# Altium schematic sheet obc_main_3.0 (1).SchDoc
size A
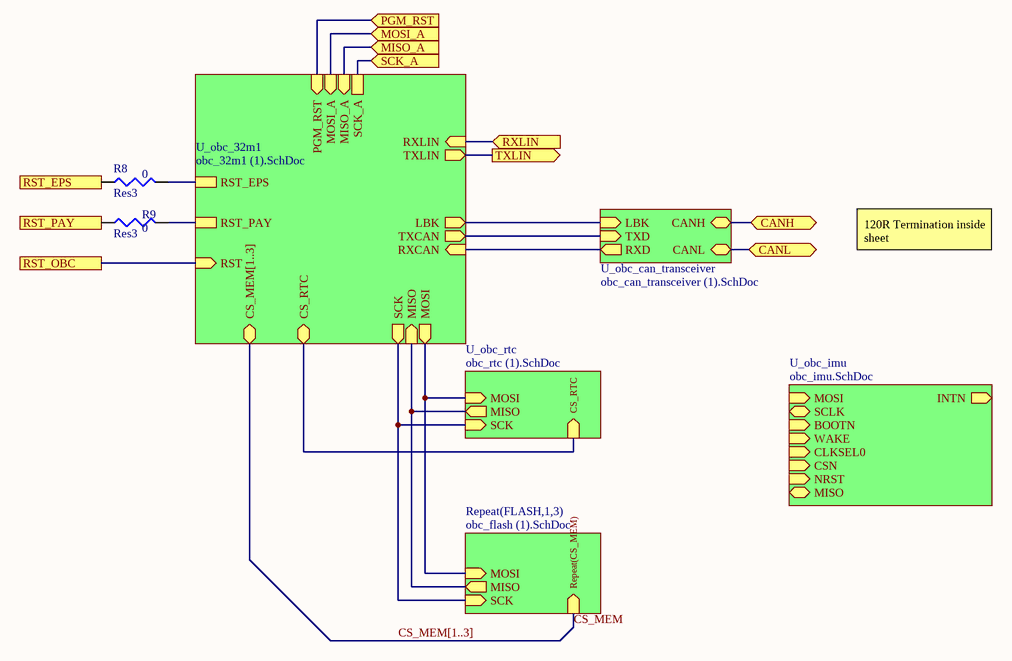
[diagram p0: obc_main_3.0 (1).SchDoc]

## Parts
R8  Res3  value 0  [J1-0603]
R9  Res3  value 0  [J1-0603]

## Sub-sheets
Repeat(FLASH,1,3) = obc_flash (1).SchDoc: MOSI (in), SCK (in), MISO (out), Repeat(CS_MEM) (in)
U_obc_32m1 = obc_32m1 (1).SchDoc: MISO (in), SCK (out), RXLIN (in), CS_RTC (bidir), TXLIN (out), TXCAN (out), RXCAN (in), MOSI (out), LBK (out), RST (in), RST_EPS, RST_PAY, PGM_RST (in), MOSI_A (in), MISO_A (in), SCK_A, CS_MEM[1..3] (bidir)
U_obc_can_transceiver = obc_can_transceiver (1).SchDoc: RXD (out), TXD (in), LBK (in), CANL (bidir), CANH (bidir)
U_obc_imu = obc_imu.SchDoc: MOSI (in), SCLK (bidir), INTN (out), BOOTN (in), WAKE (in), CLKSEL0 (in), CSN (in), NRST (in), MISO (bidir)
U_obc_rtc = obc_rtc (1).SchDoc: CS_RTC (in), MOSI (in), MISO (out), SCK (in)

## Ports
CANH (bidir), CANL (bidir), MISO_A (in), MOSI_A (in), PGM_RST (in), RST_EPS, RST_OBC, RST_PAY, RXLIN (in), SCK_A (in), TXLIN (out)

## Nets
CANH: port CANH, sheet U_obc_can_transceiver/CANH
CANL: port CANL, sheet U_obc_can_transceiver/CANL
CS_MEM: sheet Repeat(FLASH,1,3)/Repeat(CS_MEM)
MISO_A: port MISO_A, sheet U_obc_32m1/MISO_A
MOSI_A: port MOSI_A, sheet U_obc_32m1/MOSI_A
PGM_RST: port PGM_RST, sheet U_obc_32m1/PGM_RST
RST_EPS: R8.1 ; port RST_EPS
RST_OBC: port RST_OBC, sheet U_obc_32m1/RST
RST_PAY: R9.1 ; port RST_PAY
RXLIN: port RXLIN, sheet U_obc_32m1/RXLIN
SCK_A: port SCK_A, sheet U_obc_32m1/SCK_A
TXLIN: port TXLIN, sheet U_obc_32m1/TXLIN
NetR8_2: R8.2 ; sheet U_obc_32m1/RST_EPS
NetR9_2: R9.2 ; sheet U_obc_32m1/RST_PAY
(unnamed): sheet U_obc_32m1/MISO, sheet U_obc_rtc/MISO, sheet Repeat(FLASH,1,3)/MISO
(unnamed): sheet U_obc_32m1/SCK, sheet U_obc_rtc/SCK, sheet Repeat(FLASH,1,3)/SCK
(unnamed): sheet U_obc_32m1/CS_RTC, sheet U_obc_rtc/CS_RTC
(unnamed): sheet U_obc_32m1/TXCAN, sheet U_obc_can_transceiver/TXD
(unnamed): sheet U_obc_32m1/RXCAN, sheet U_obc_can_transceiver/RXD
(unnamed): sheet U_obc_32m1/MOSI, sheet U_obc_rtc/MOSI, sheet Repeat(FLASH,1,3)/MOSI
(unnamed): sheet U_obc_32m1/LBK, sheet U_obc_can_transceiver/LBK

## Buses and harness runs
bus CS_MEM[1..3] = sheet U_obc_32m1/CS_MEM[1..3]

## Notes on the sheet
- 120R Termination inside sheet

## Library data of the parts
R8 R9 = Res3: Resistor; Published: 8-Jun-2000; LatestRevisionDate: 29-May-2009; LatestRevisionNote: IPC-7351 Footprint Added.; PackageReference: J1-0603; Publisher: Altium Limited; PackageDescription: Chip Resistor